# Altium schematic sheet AMSLATCH23-ESF.SchDoc
size 199 x 149 mm
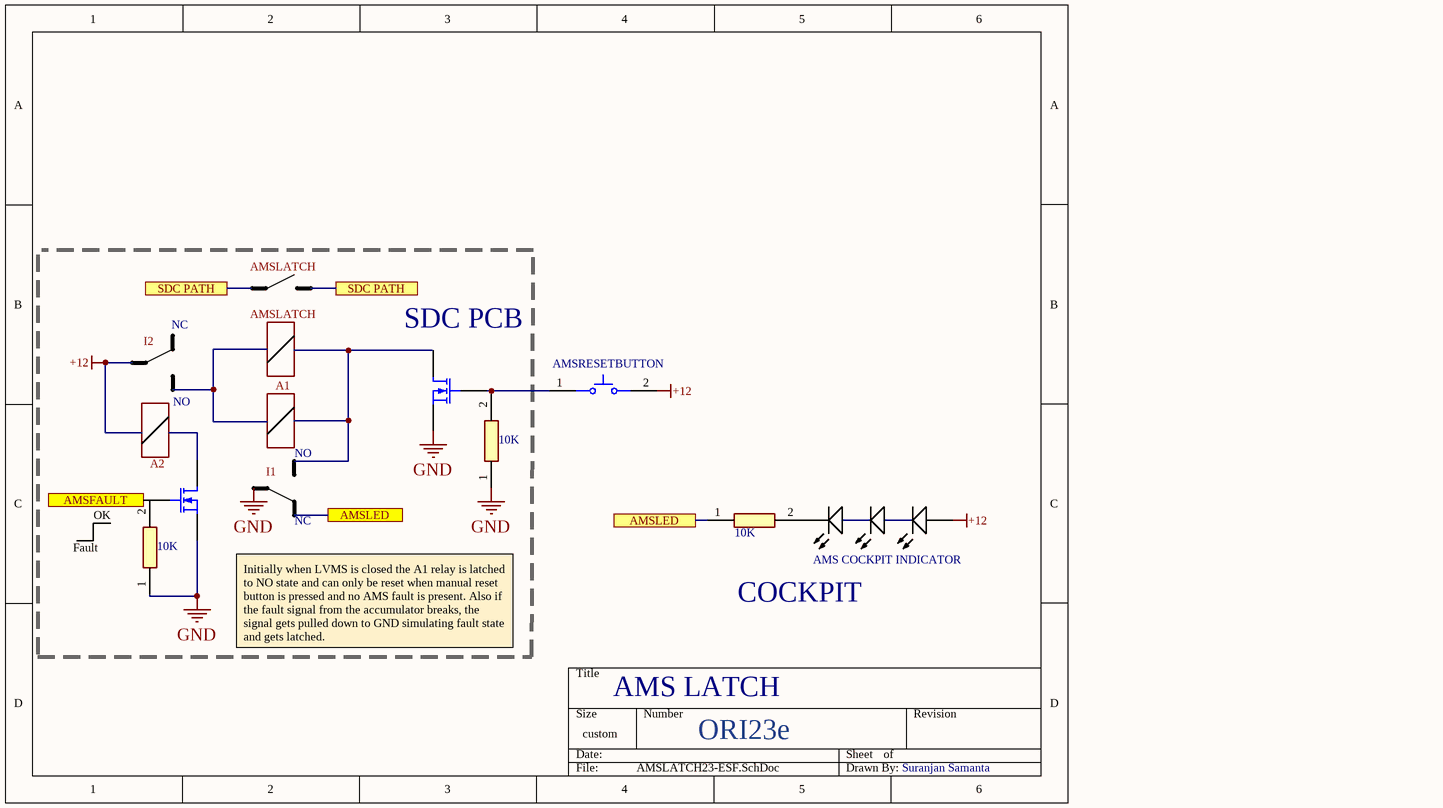
[diagram p0: AMSLATCH23-ESF.SchDoc]

## Parts
(Parts that share a designator on the sheet are numbered #1, #2 ... from top to bottom, then left to right.)
?#1  STD10NF10T4  [E3]  (value not drawn)
?#2  STD10NF10T4  [E3]  (value not drawn)
?#3  WURTH LED  [AVAG-HSMW-C191_V]  (value not drawn)
?#4  AMS COCKPIT INDICATOR  [AVAG-HSMW-C191_V]
?#5  WURTH LED  [AVAG-HSMW-C191_V]  (value not drawn)
AMSRESETBUTTON  (no value)  [OMRON-B3U-1000_V]
R?#1  10K  [RESC3126X60N]
R?#2  10K  [RESC3126X60N]
R?#3  10K  [RESC0603X28N]

## Ports
AMSFAULT, AMSLED, SDC PATH

## Nets
+12: ?#5.1(A) AMSRESETBUTTON.2
GND: ?#1.3(S) ?#2.3(S) R?#1.1 R?#3.1
AMSFAULT: ?#2.2(G) ; port AMSFAULT
AMSLED: R?#2.1 ; port AMSLED
Net?#1_2: ?#1.2(G) AMSRESETBUTTON.1 R?#1.2
Net?#3_1: ?#3.1(A) ?#4.2(K)
Net?#3_2: ?#3.2(K) R?#2.2
Net?#4_1: ?#4.1(A) ?#5.2(K)

Not connected (* = marked no-connect by the designer): ?#1 1(D); ?#2 1(D); R?#3 2

## Notes on the sheet
- AMSLATCH
- I2
- NC
- (near ?#1) SDC PCB
- NO
- A1
- (near ?#2) A2
- I1
- Fault
- OK
- COCKPIT
- Initially when LVMS is closed the A1 relay is latched to NO state and can only be reset when manual reset button is pressed and no AMS fault is present. Also if the fault signal from the accumulator breaks, the signal gets pulled down to GND simulating fault state and gets latched.
- AMS LATCH
- ORI23e
- Suranjan Samanta
- Labels drawn without touching a wire or pin: GND

## Library data of the parts
?#1 ?#2 = MOSFET-N: N-Channel MOSFET; Published: 8-Jun-2000; LatestRevisionDate: 17-Jul-2002; LatestRevisionNote: Re-released for DXP Platform.; PackageVersion: 1995/1996; PackageReference: E3; Publisher: Altium Limited; PackageDescription: TO, Flat Index; 3 In-Line, Axial Leads; Body Dia. 4.6mm; Lead Dia. 0.5 mm (max)
?#3-?#5 = CMP-1744-00001-1: LED Uni-Color White, 78 mW, 20 mA, -40 to 85 degC, 2-Pin SMD, RoHS, Tape and Reel; Current Rating: 300 mA; Contact Plating: Silver; Width: 12 mm; Package Quantity: 560; ComponentLink2URL: http://docs.avagotech.com/docs/AV02-0186EN; ComponentLink1URL: http://www.avagotech.com/; RoHSCompliant: true; PackageDescription: 2-Pin Surface Mount Device, Body 1.6 x 0.8 mm; Contact Material: Copper; ComponentLink1Description: Manufacturer URL; Mount: Through Hole; Packaging: Bulk; DatasheetVersion: May-10; Height: 12 mm; ComponentLink2Description: Datasheet; Contact Finish: Silver; Max Operating Temperature: 85 degC; Radiation Hardening: No; PackageReference: HSMW-C191; REACH SVHC: Unknown; Min Operating Temperature: -20 degC; Length: 16 mm
AMSRESETBUTTON = CMP-2100-03586-1: Ultra-Small Tactile Switch, 0.05 A, 12 V, -25 to 70 degC, 2-Pin SMD, RoHS, Tape and Reel; Manufacturer: Omron Electronic Components; Operating Force: 1.5N; Current Rating: 50mA; Voltage Rating (DC): 12V; Electrical Life: 200000Cycles; Actuator Length: 0.4mm; Insulation Resistance: 100MOhm; Switch Travel: 0.15mm; Throw Configuration: SPST; Illumination Type: Illuminated; Width: 3mm; Weight: 0.022g; Datasheet Version: 42005.0; Datasheet URL: http://www.omron.com/ecb/products/pdf/en-b3u.pdf; Height: 1.2mm; Package Quantity: 1; REACH SVHC: Unknown; Contact Current Rating: 50mA; Contact Material: Silver; Max Current Rating: 50mA; Package Reference: B3U-1000; Termination: SMD/SMT; Packaging: TapeandReel; Manufacturer URL: http://www.omron.com/; RoHSCompliant: true; Mount: SurfaceMount; Length: 4mm; Min Operating Temperature: -25degC; Depth: 2.5mm; Lead Free: LeadFree; Case/Package: SMD/SMT; Package Description: 2-Pin Surface Mount Device, Body 3 x 2.5 mm; Max Operating Temperature: 70degC; Orientation: Straight
R?#1 R?#2 = RC1210JR-0710KL: Resistor; Manufacturer_Name: YAGEO (PHYCOMP); Datasheet Link: http://www.yageo.com/documents/recent/PYu-RC1210_51_RoHS_L_(4).pdf; Height: 0.6mm; Manufacturer_Part_Number: RC1210JR-0710KL; Mouser Part Number: 603-RC1210JR-0710KL; Mouser Price/Stock: https://www.mouser.com/Search/Refine.aspx?Keyword=603-RC1210JR-0710KL
R?#3 = CPF0201D100RE1: Resistor; Manufacturer_Name: TE Connectivity; Datasheet Link: http://www.te.com/commerce/DocumentDelivery/DDEController?Action=showdoc&DocId=Data+Sheet%7F1773200-1%7FA%7Fpdf%7FEnglish%7FENG_DS_1773200-1_A.pdf%7F4-2176215-6; Height: 0.28mm; Manufacturer_Part_Number: CPF0201D100RE1; Mouser Part Number: 279-CPF0201D100RE1; Mouser Price/Stock: https://www.mouser.com/Search/Refine.aspx?Keyword=279-CPF0201D100RE1; RS Part Number: 7549192; RS Price/Stock: http://uk.rs-online.com/web/p/products/7549192